# Altium schematic sheet ESP32S3.SchDoc
size A3; SheetNumber: 3; SheetTotal: 5
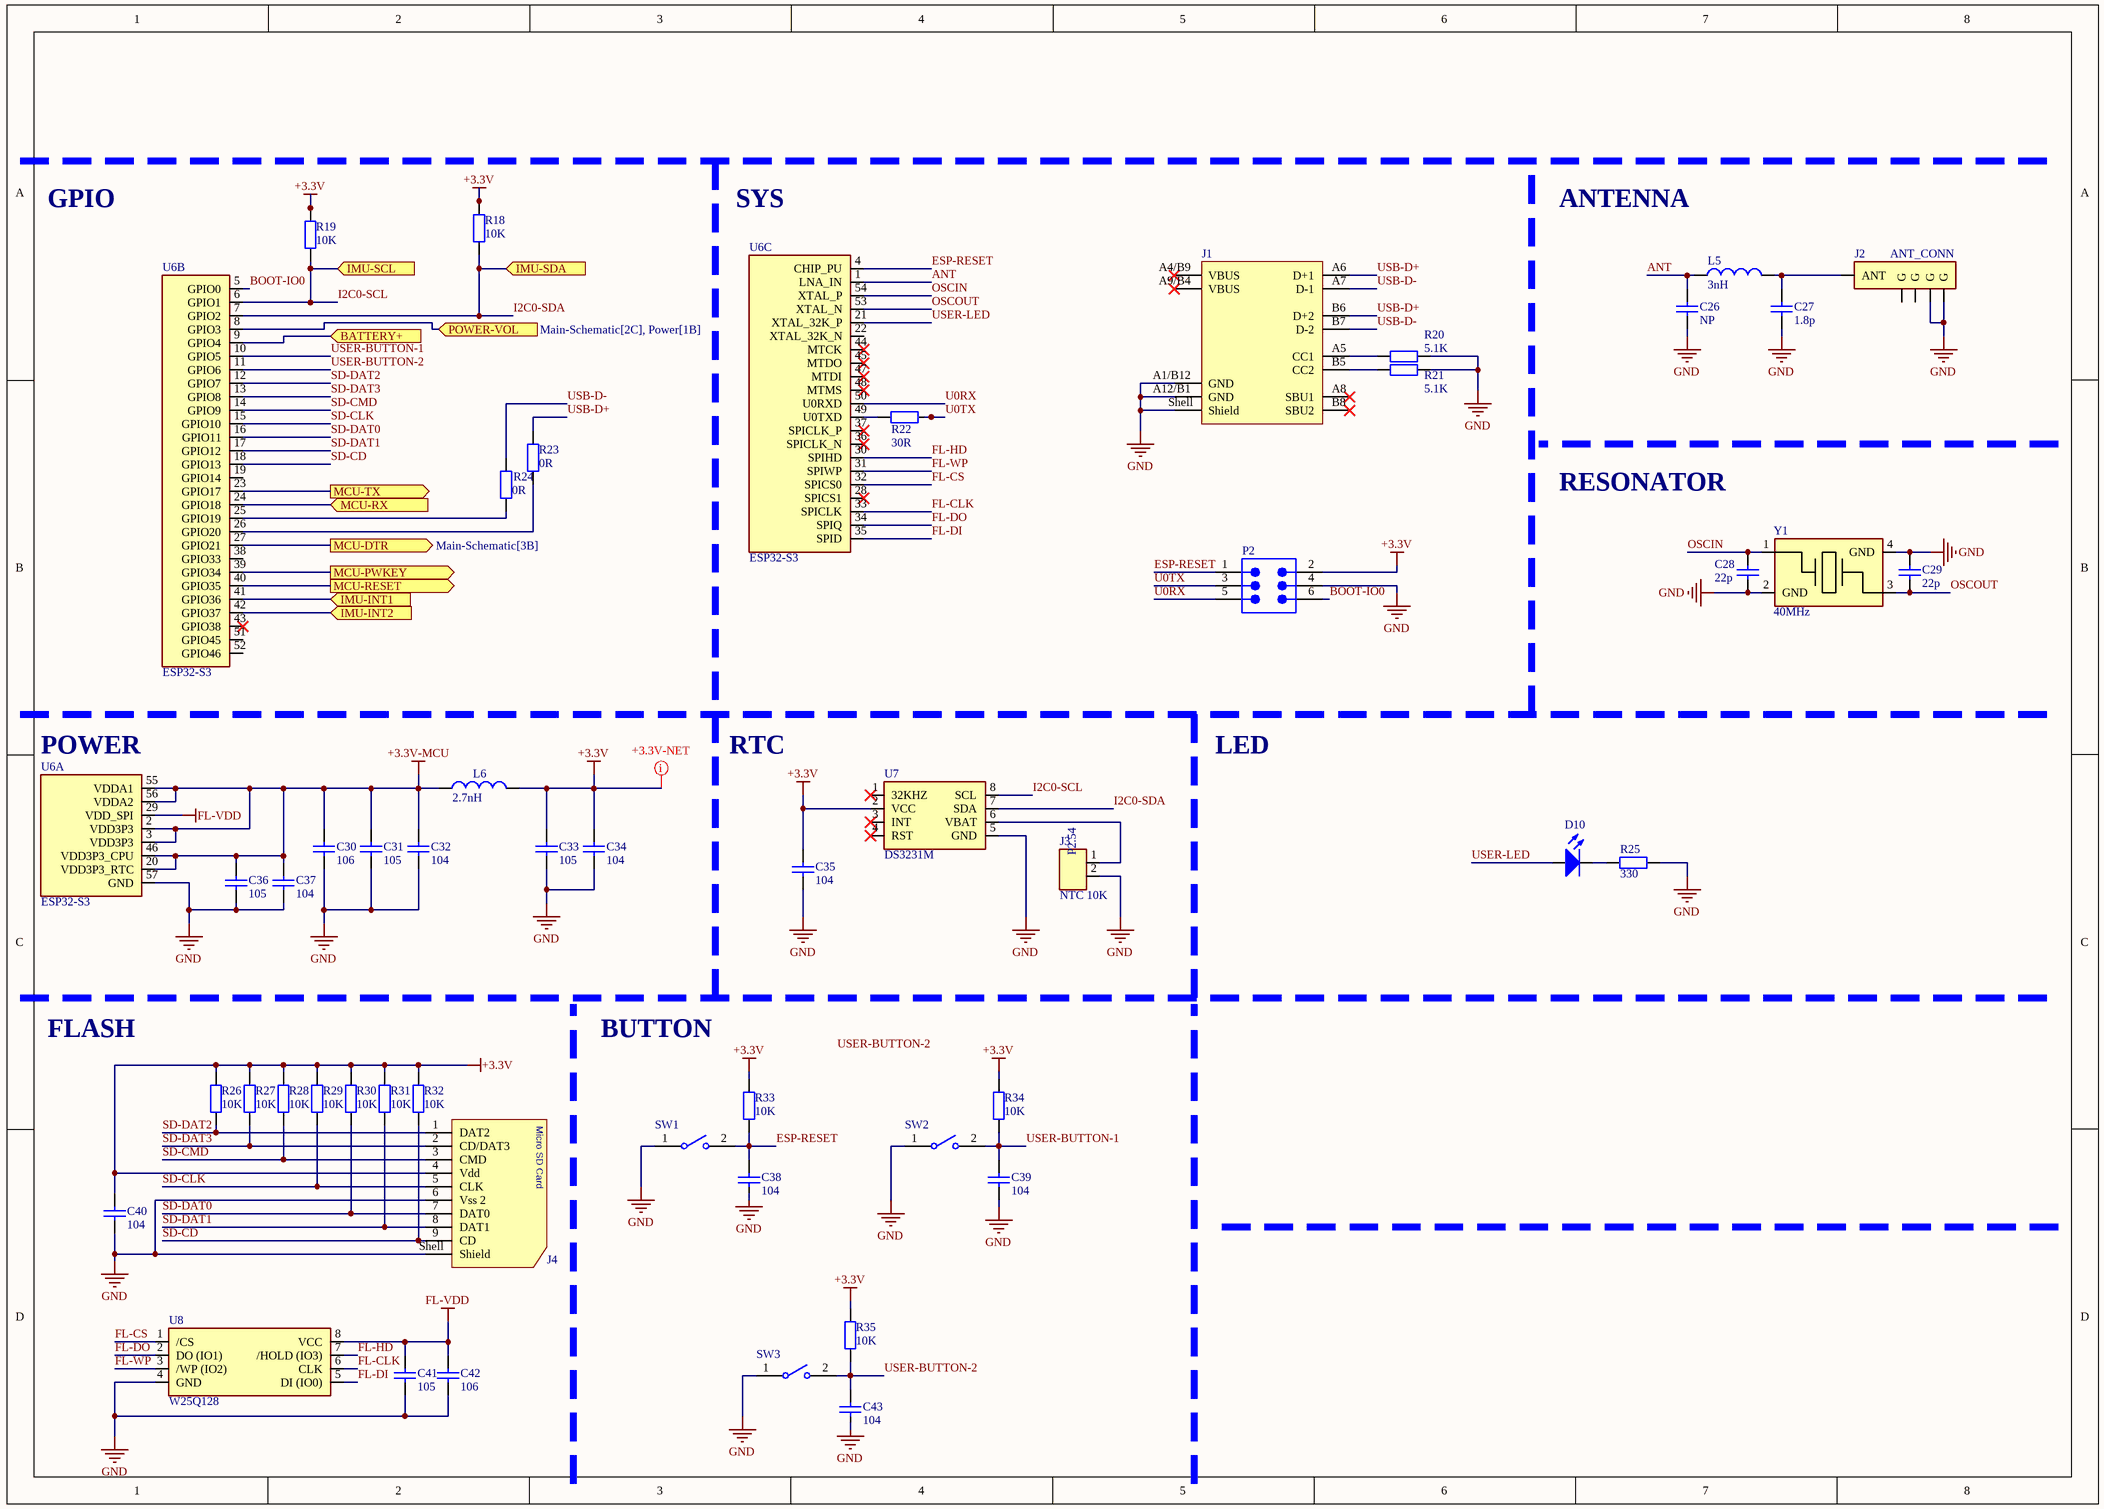
[diagram p0: ESP32S3.SchDoc]

## Parts
C26  NP  [CAP_0603]
C27  1.8p  [CAP_0603]
C28  22p  [CAP_0603]
C29  22p  [CAP_0603]
C30  106  [CAP_0603]
C31  105  [CAP_0603]
C32  104  [CAP_0603]
C33  105  [CAP_0603]
C34  104  [CAP_0603]
C35  104  [CAP_0603]
C36  105  [CAP_0603]
C37  104  [CAP_0603]
C38  104  [CAP_0603]
C39  104  [CAP_0603]
C40  104  [CAP_0603]
C41  105  [CAP_0603]
C42  106  [CAP_0603]
C43  104  [CAP_0603]
D10  (no value)  [LED-0805-Red]
J1  629722000214  [629722000214]  (value not drawn)
J2  ANT_CONN  [IPEX]
J3  NTC 10K  [XH2.54M-2]
J4  693071040911  [693071040911]  (value not drawn)
L5  3nH  [INDC-0805]
L6  2.7nH  [INDC-0805]
P2  61200621621  [61200621621]  (value not drawn)
R18  10K  [RES_0603]
R19  10K  [RES_0603]
R20  5.1K  [RES_0603]
R21  5.1K  [RES_0603]
R22  30R  [RES_0603]
R23  0R  [RES_0603]
R24  0R  [RES_0603]
R25  330  [RES_0603]
R26  10K  [RES_0603]
R27  10K  [RES_0603]
R28  10K  [RES_0603]
R29  10K  [RES_0603]
R30  10K  [RES_0603]
R31  10K  [RES_0603]
R32  10K  [RES_0603]
R33  10K  [RES_0603]
R34  10K  [RES_0603]
R35  10K  [RES_0603]
SW1  434121050816  [434121050816]  (value not drawn)
SW2  434121050816  [434121050816]  (value not drawn)
SW3  434121050816  [434121050816]  (value not drawn)
U6  ESP32-S3  [QFN56]  (parts A,B,C of 3)
U7  DS3231M  [SOP8-P1.27]
U8  W25Q128  [SOIC127P790X216-8N]
Y1  40MHz  [Y-3225]

## Ports
BATTERY+ (in, see Main-Schematic[2B], Power[4B]), IMU-INT1 (in, see Main-Schematic[3C], LIS3DH[3B]), IMU-INT2 (in, see Main-Schematic[3C], LIS3DH[3B]), IMU-SCL (in, see Main-Schematic[3C], LIS3DH[2C]), IMU-SDA (in, see Main-Schematic[3C], LIS3DH[2C]), MCU-DTR (out, see Main-Schematic[3B]), MCU-PWKEY (out, see Main-Schematic[3B]), MCU-RESET (out, see Main-Schematic[3B]), MCU-RX (in, see Main-Schematic[3B]), MCU-TX (out, see Main-Schematic[3B]), POWER-VOL (in, see Main-Schematic[2C], Power[1B])

## Nets
+3.3V: C33.2 C34.2 C35.1 C40.2 J4.4(Vdd) L6.2 P2.2 R18.2 R19.2 R26.2 R27.2 R28.2 R29.2 R30.2 R31.2 R32.2 R33.2 R34.2 R35.2 U7.2(VCC)
+3.3V-MCU: C30.2 C31.2 C32.2 C36.2 C37.2 L6.1 U6.2(VDD3P3) U6.3(VDD3P3) U6.20(VDD3P3_RTC) U6.46(VDD3P3_CPU) U6.55(VDDA1) U6.56(VDDA2)
FL-VDD: C41.2 C42.2 U6.29(VDD_SPI) U8.8(VCC)
GND: C26.1 C27.1 C28.1 C29.2 C30.1 C31.1 C32.1 C33.1 C34.1 C35.2 C36.1 C37.1 C38.2 C39.2 C40.1 C41.1 C42.1 C43.2 J1.A1/B12(GND) J1.A12/B1(GND) J1.Shell(Shield) J2.4(G) J2.5(G) J3.2 J4.6(Vss_2) J4.Shell(Shield) P2.4 R20.2 R21.2 R25.2 SW1.1 SW2.1 SW3.1 U6.57(GND) U7.5(GND) U8.4(GND) Y1.2(GND) Y1.4(GND)
ANT: C26.2 L5.1 U6.1(LNA_IN)
BATTERY+: U6.9(GPIO4) ; port BATTERY+
BOOT-IO0: P2.6 U6.5(GPIO0)
ESP-RESET: C38.1 P2.1 R33.1 SW1.2 U6.4(CHIP_PU)
FL-CLK: U6.33(SPICLK) U8.6(CLK)
FL-CS: U6.32(SPICS0) U8.1(/CS)
FL-DI: U6.35(SPID) U8.5(DI_(IO0))
FL-DO: U6.34(SPIQ) U8.2(DO_(IO1))
FL-HD: U6.30(SPIHD) U8.7(/HOLD_(IO3))
FL-WP: U6.31(SPIWP) U8.3(/WP_(IO2))
I2C0-SCL: R19.1 U6.6(GPIO1) U7.8(SCL) ; port IMU-SCL
I2C0-SDA: R18.1 U6.7(GPIO2) U7.7(SDA) ; port IMU-SDA
IMU-INT1: U6.41(GPIO36) ; port IMU-INT1
IMU-INT2: U6.42(GPIO37) ; port IMU-INT2
MCU-DTR: U6.27(GPIO21) ; port MCU-DTR
MCU-PWKEY: U6.39(GPIO34) ; port MCU-PWKEY
MCU-RESET: U6.40(GPIO35) ; port MCU-RESET
MCU-RX: U6.24(GPIO18) ; port MCU-RX
MCU-TX: U6.23(GPIO17) ; port MCU-TX
OSCIN: C28.2 U6.54(XTAL_P) Y1.1(OSCIN)
OSCOUT: C29.1 U6.53(XTAL_N) Y1.3(OSCOUT)
POWER-VOL: U6.8(GPIO3) ; port POWER-VOL
SD-CD: J4.9(CD) R32.1 U6.18(GPIO13)
SD-CLK: J4.5(CLK) R29.1 U6.15(GPIO10)
SD-CMD: J4.3(CMD) R28.1 U6.14(GPIO9)
SD-DAT0: J4.7(DAT0) R30.1 U6.16(GPIO11)
SD-DAT1: J4.8(DAT1) R31.1 U6.17(GPIO12)
SD-DAT2: J4.1(DAT2) R26.1 U6.12(GPIO7)
SD-DAT3: J4.2(CD/DAT3) R27.1 U6.13(GPIO8)
U0RX: P2.5 U6.50(U0RXD)
U0TX: P2.3 R22.2
USB-D+: J1.A6(D+1) J1.B6(D+2) R23.2
USB-D-: J1.A7(D-1) J1.B7(D-2) R24.2
USER-BUTTON-1: C39.1 R34.1 SW2.2 U6.10(GPIO5)
USER-BUTTON-2: C43.1 R35.1 SW3.2 U6.11(GPIO6)
USER-LED: D10.1(A) U6.21(XTAL_32K_P)
NetC27_2: C27.2 J2.1(ANT) L5.2
NetD10_2: D10.2(K) R25.1
NetJ1_A5: J1.A5(CC1) R20.1
NetJ1_B5: J1.B5(CC2) R21.1
NetJ3_1: J3.1 U7.6(VBAT)
NetR22_1: R22.1 U6.49(U0TXD)
NetR23_1: R23.1 U6.26(GPIO20)
NetR24_1: R24.1 U6.25(GPIO19)

Not connected (* = marked no-connect by the designer): J1 A4/B9(VBUS)* A8(SBU1)* A9/B4(VBUS)* B8(SBU2)*; J2 2(G) 3(G); U6 19(GPIO14) 22(XTAL_32K_N) 28(SPICS1)* 36(SPICLK_N)* 37(SPICLK_P)* 38(GPIO33) 43(GPIO38)* 44(MTCK)* 45(MTDO)* 47(MTDI)* 48(MTMS)* 51(GPIO45) 52(GPIO46); U7 1(32KHZ)* 3(INT)* 4(RST)*

## Layout directives
net class POWER: +3.3V

## Notes on the sheet
- GPIO
- SYS
- ANTENNA
- RESONATOR
- (near U6) POWER
- RTC
- LED
- FLASH
- BUTTON
- Labels drawn without touching a wire or pin: USER-BUTTON-2
- (in symbol Conn_Cai_2P_2.54) P2.54

## Library data of the parts
C26-C43 = Cap_NP: Non-polarized capacitor
D10 = LED: Light Emitting Diode
J1 = 629722000214: WR-COM USB 2.0 Type C Receptacle Horizontal SMT; Manufacturer: Wurth Elektronik; Match Code: WR-USB; Interface Type: Type C; Number of Ports: 1; Rated Current: 5; Working Voltage: 48V (DC); Manufacturer Part Number: 629722000214; Category: Input/Output Connector; ComponentLink1Description: Website Link; ComponentLink1URL: https://www.we-online.com/redexpert/article/629722000214?ad; ComponentLink2Description: Datasheet Link; ComponentLink2URL: https://www.we-online.com/redexpert/spec/629722000214?ad; Mount: Surface Mount; Min Operating Temperature: -40°C; Max Operating Temperature: 85°C; Packaging: Tape and Reel; Application: USB 2.0; Gender: Receptacle; Number of Pins: 16; Orientation: Horizontal
J2 = ANT_CONN: ATENNA PIN 1
J3 = Conn_Cai_2P_2.54
J4 = 693071040911: WR-CRD SD Card Connector Push & Push Socket, 9 pins; Manufacturer: Wurth Elektronik; Durability: 10000 Mating cycles; Manufacturer Part Number: 693071040911; Category: Input/Output Connector; Match Code: WR-CRD; ComponentLink1Description: Website Link; ComponentLink1URL: https://www.we-online.com/redexpert/article/693071040911?ad; ComponentLink2Description: Datasheet Link; ComponentLink2URL: https://www.we-online.com/redexpert/spec/693071040911?ad; Mount: Surface Mount; Min Operating Temperature: -25 °C; Max Operating Temperature: 85 °C; Packaging: Tape and Reel; Application: Micro SD Card; Gender: Socket; Number of Pins: 9; Type: Push & Push
L5 L6 = Inductor: Code_IEC: 1005; Published: 8-Jun-2000; LatestRevisionDate: 29-May-2009; LatestRevisionNote: IPC-7351 Footprint Added.; PackageReference: 0402-A; Publisher: Altium Limited; PackageDescription: Chip Inductor; Code_JEITA: 0402
P2 = 61200621621: WR-BHD Male Box Header, THT Straight, pitch 2.54 mm, 2 Rows, 6 Pins; Manufacturer: Wurth Elektronik; Contact Resistance: 20 mΩ; Insulation Resistance: 1000 MΩ; Pitch: 2.54 mm; Rated Current: 3 A; Working Voltage: 250 V; Withstanding Voltage: 500 V; Manufacturer Part Number: 61200621621; Category: Wire-to-Board Connector; Match Code: WR-BHD; ComponentLink1Description: Website Link; ComponentLink1URL: https://www.we-online.com/redexpert/article/61200621621?ad; ComponentLink2Description: Datasheet Link; ComponentLink2URL: https://www.we-online.com/redexpert/spec/61200621621?ad; Mount: Through Hole; Min Operating Temperature: -40 °C; Max Operating Temperature: 105 °C; Packaging: Tray; Length: 15.28 mm; Width: 9.1 mm; Height: 9.1 mm; Gender: Male; Number of Pins: 6; Number of Rows: 2; Orientation: Straight
R18-R35 = Resistor
SW1-SW3 = 434121050816: WS-TASV SMT Tact Switch, 6mm x 3.5mm, 160gf, SPST-NO, 12V, 50mA; Manufacturer: Wurth Elektronik; Washable: No; Manufacturer Part Number: 434121050816; Category: Tact Switch; Match Code: WS-TASV; ComponentLink1Description: Website Link; ComponentLink1URL: https://www.we-online.com/redexpert/article/434121050816?ad; ComponentLink2Description: Datasheet Link; ComponentLink2URL: https://www.we-online.com/redexpert/spec/434121050816?ad; Mount: Surface Mount; Min Operating Temperature: -40°C; Max Operating Temperature: 85°C; Packaging: Tape and Reel; Length: 6mm; Width: 3.5mm; Height: 5mm; Circuit: SPST-NO; Contact Material: Stainless Steel; Contact Plating: Silver; Operation Force: 160gf; Rated Current: 50mA; Rated Voltage (DC): 12V; Terminal Material: Copper Alloy; Terminal Plating: Silver
U7 = DS3231M: I2C realtime clock (RTC)
U8 = W25Q256JV: 256M-bit (32MB) Serial Flash memory
Y1 = Resonator